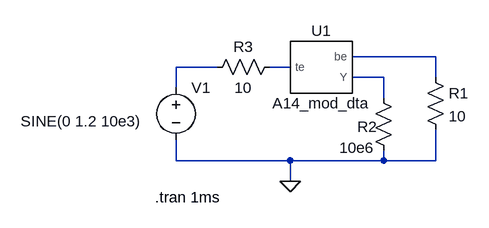
[diagram p0: schematic mem_a14_20_feb_2024.asc]
mem_a14_20_feb_2024.asc, the LTspice schematic file:
Version 4
SHEET 1 880 680
WIRE 432 128 304 128
WIRE 96 144 32 144
WIRE 208 144 176 144
WIRE 352 160 304 160
WIRE 432 160 432 128
WIRE 32 176 32 144
WIRE 352 192 352 160
WIRE 32 288 32 256
WIRE 208 288 32 288
WIRE 352 288 352 272
WIRE 352 288 208 288
WIRE 432 288 432 240
WIRE 432 288 352 288
WIRE 208 320 208 288
FLAG 208 320 0
SYMBOL voltage 32 160 R0
WINDOW 3 -239 67 Left 2
WINDOW 123 0 0 Left 0
WINDOW 39 0 0 Left 0
SYMATTR Value SINE(0 1.2 10e3)
SYMATTR InstName V1
SYMBOL res 336 176 R0
WINDOW 0 -25 60 Left 2
WINDOW 3 -52 92 Left 2
SYMATTR InstName R2
SYMATTR Value 10e6
SYMBOL res 192 128 R90
WINDOW 0 0 56 VBottom 2
WINDOW 3 32 56 VTop 2
SYMATTR InstName R3
SYMATTR Value 10
SYMBOL res 416 144 R0
SYMATTR InstName R1
SYMATTR Value 10
SYMBOL AutoGenerated\\A14_mod_dta 256 144 R0
SYMATTR InstName U1
TEXT 0 344 Left 2 !.tran 1ms

The netlist it stands for:
* mem_a14_20_feb_2024.asc
V1 N002 0 SINE(0 1.2 10e3)
R2 N004 0 10e6
R3 N003 N002 10
R1 N001 0 10
XU1 N003 N001 N004 A14_mod_dta  ; pins te be Y
.tran 1ms
.lib C:\users\luis\Mis Documentos\memristor\A14_mod.cir
.backanno
.end